# Altium project Switchberry.PrjPcb
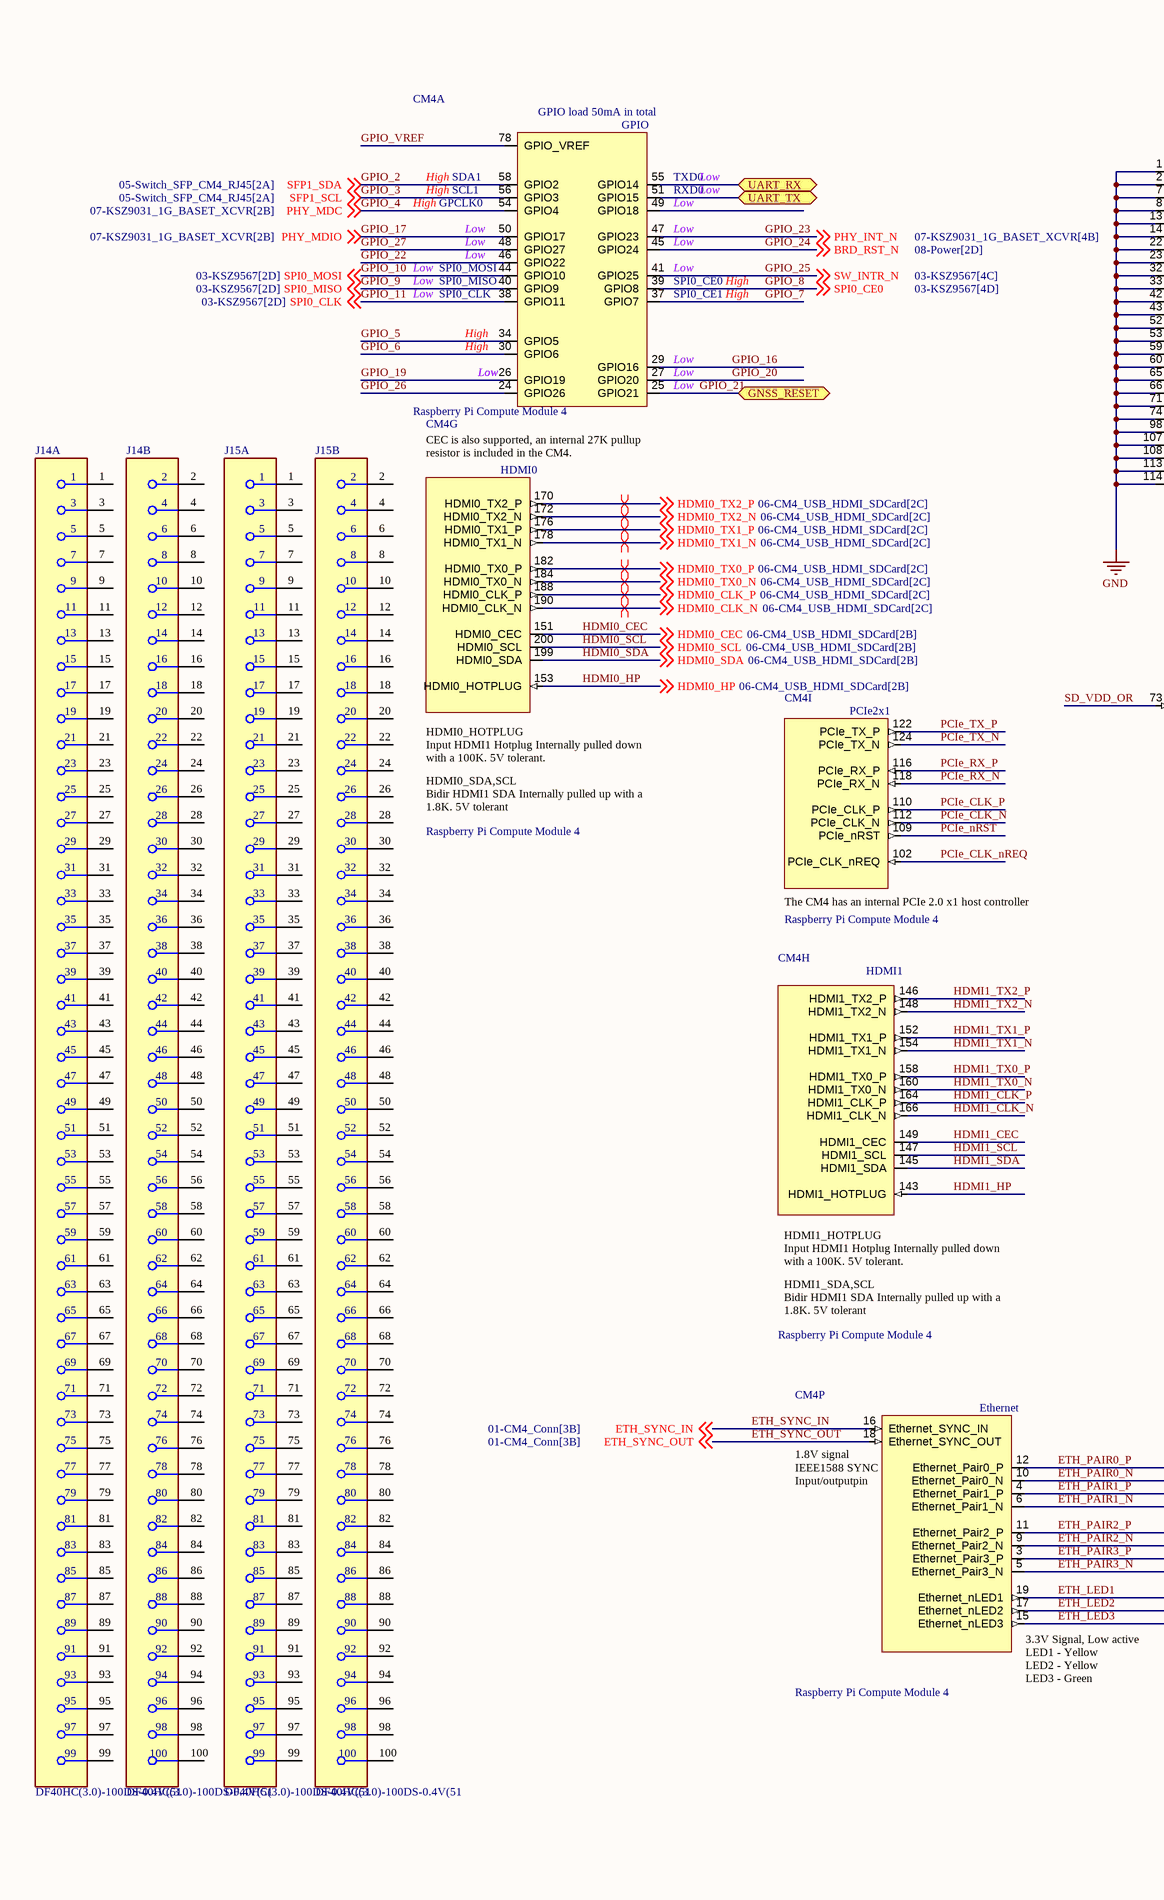
[diagram p0: 01-CM4_Conn.SchDoc, left]
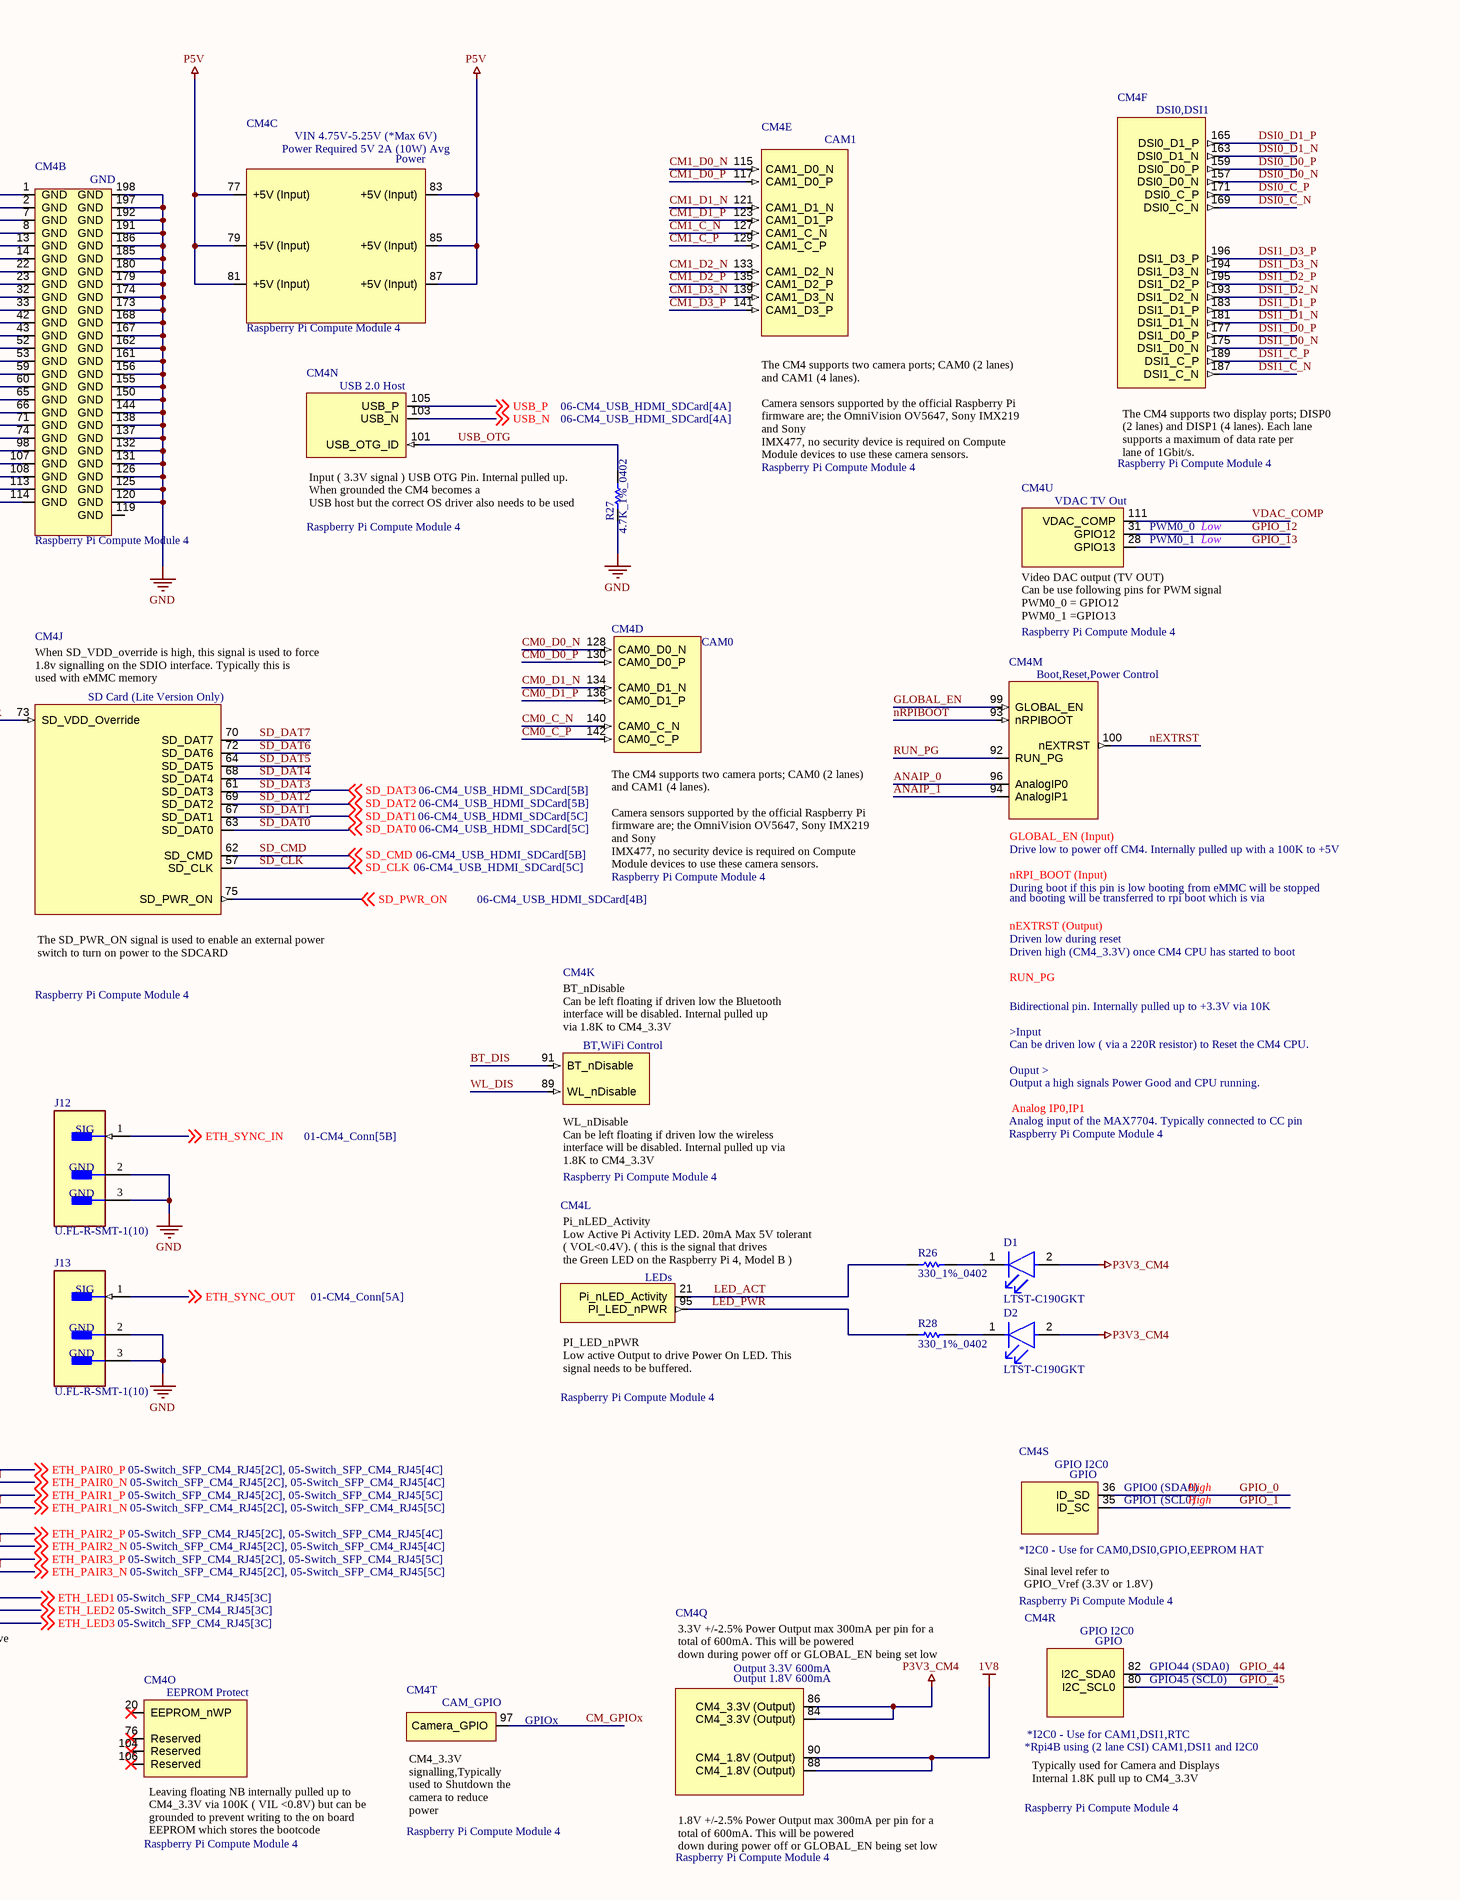
[diagram p1: 01-CM4_Conn.SchDoc, right]
3 sheets, 155 parts. Net scope: global (net labels, ports and power ports of the same name join across sheets).
Board file: Switchberry.PcbDoc
Sheets:
  01-CM4_Conn.SchDoc
  08-Power.SchDoc
  09-Switch_Power_Filters.SchDoc

## Sheet 01-CM4_Conn.SchDoc
size C; SheetNumber: 1; SheetTotal: 11

### Parts
CM4  Raspberry Pi Compute Module 4  [CM4-F40C-100DS-0.4v_1.5mm_0mm]  (parts A,B,C,D,E,F,G,H,I,J,K,L,M,N,O,P,Q,R,S,T,U of 21)  (no BOM)
D1  LTST-C190GKT  [FP-LTST-C190GKT-MFG]
D2  LTST-C190GKT  [FP-LTST-C190GKT-MFG]
J12  U.FL-R-SMT-1(10)  [FP-U_FL-R-SMT-1_10-MFG]
J13  U.FL-R-SMT-1(10)  [FP-U_FL-R-SMT-1_10-MFG]
J14  DF40HC(3.0)-100DS-0.4V(51  [FP-DF40HC_3_0_-100DS-0_4V-MFG]  (parts A,B of 2)
J15  DF40HC(3.0)-100DS-0.4V(51  [FP-DF40HC_3_0_-100DS-0_4V-MFG]  (parts A,B of 2)
R26  330_1%_0402  [RESC1005X40X25NL10T10]
R27  4.7K_1%_0402  [RESC1005X40X25NL10T10]
R28  330_1%_0402  [RESC1005X40X25NL10T10]

### Ports
GNSS_RESET (bidir), UART_RX (bidir), UART_TX (bidir)

### Nets
1V8: CM4.88(CM4_1.8V_(Output)) CM4.90(CM4_1.8V_(Output))
GND: CM4.1(GND) CM4.2(GND) CM4.7(GND) CM4.8(GND) CM4.13(GND) CM4.14(GND) CM4.22(GND) CM4.23(GND) CM4.32(GND) CM4.33(GND) CM4.42(GND) CM4.43(GND) CM4.52(GND) CM4.53(GND) CM4.59(GND) CM4.60(GND) CM4.65(GND) CM4.66(GND) CM4.71(GND) CM4.74(GND) CM4.98(GND) CM4.107(GND) CM4.108(GND) CM4.113(GND) CM4.114(GND) CM4.120(GND) CM4.125(GND) CM4.126(GND) CM4.131(GND) CM4.132(GND) CM4.137(GND) CM4.138(GND) CM4.144(GND) CM4.150(GND) CM4.155(GND) CM4.156(GND) CM4.161(GND) CM4.162(GND) CM4.167(GND) CM4.168(GND) CM4.173(GND) CM4.174(GND) CM4.179(GND) CM4.180(GND) CM4.185(GND) CM4.186(GND) CM4.191(GND) CM4.192(GND) CM4.197(GND) CM4.198(GND) J12.2(GND) J12.3(GND) J13.2(GND) J13.3(GND) R27.2
P3V3_CM4: CM4.84(CM4_3.3V_(Output)) CM4.86(CM4_3.3V_(Output)) D1.2(A) D2.2(A)
P5V: CM4.77(+5V_(Input)) CM4.79(+5V_(Input)) CM4.81(+5V_(Input)) CM4.83(+5V_(Input)) CM4.85(+5V_(Input)) CM4.87(+5V_(Input))
ANAIP_0: CM4.96(AnalogIP0)
ANAIP_1: CM4.94(AnalogIP1)
BT_DIS: CM4.91(BT_nDisable)
CM0_C_N: CM4.140(CAM0_C_N)
CM0_C_P: CM4.142(CAM0_C_P)
CM0_D0_N: CM4.128(CAM0_D0_N)
CM0_D0_P: CM4.130(CAM0_D0_P)
CM0_D1_N: CM4.134(CAM0_D1_N)
CM0_D1_P: CM4.136(CAM0_D1_P)
CM1_C_N: CM4.127(CAM1_C_N)
CM1_C_P: CM4.129(CAM1_C_P)
CM1_D0_N: CM4.115(CAM1_D0_N)
CM1_D0_P: CM4.117(CAM1_D0_P)
CM1_D1_N: CM4.121(CAM1_D1_N)
CM1_D1_P: CM4.123(CAM1_D1_P)
CM1_D2_N: CM4.133(CAM1_D2_N)
CM1_D2_P: CM4.135(CAM1_D2_P)
CM1_D3_N: CM4.139(CAM1_D3_N)
CM1_D3_P: CM4.141(CAM1_D3_P)
CM_GPIOx: CM4.97(Camera_GPIO)
DSI0_C_N: CM4.169(DSI0_C_N)
DSI0_C_P: CM4.171(DSI0_C_P)
DSI0_D0_N: CM4.157(DSI0_D0_N)
DSI0_D0_P: CM4.159(DSI0_D0_P)
DSI0_D1_N: CM4.163(DSI0_D1_N)
DSI0_D1_P: CM4.165(DSI0_D1_P)
DSI1_C_N: CM4.187(DSI1_C_N)
DSI1_C_P: CM4.189(DSI1_C_P)
DSI1_D0_N: CM4.175(DSI1_D0_N)
DSI1_D0_P: CM4.177(DSI1_D0_P)
DSI1_D1_N: CM4.181(DSI1_D1_N)
DSI1_D1_P: CM4.183(DSI1_D1_P)
DSI1_D2_N: CM4.193(DSI1_D2_N)
DSI1_D2_P: CM4.195(DSI1_D2_P)
DSI1_D3_N: CM4.194(DSI1_D3_N)
DSI1_D3_P: CM4.196(DSI1_D3_P)
ETH_LED1: CM4.19(Ethernet_nLED1) ; off-sheet ETH_LED1
ETH_LED2: CM4.17(Ethernet_nLED2) ; off-sheet ETH_LED2
ETH_LED3: CM4.15(Ethernet_nLED3) ; off-sheet ETH_LED3
ETH_PAIR0_N: CM4.10(Ethernet_Pair0_N) ; off-sheet ETH_PAIR0_N
ETH_PAIR0_P: CM4.12(Ethernet_Pair0_P) ; off-sheet ETH_PAIR0_P
ETH_PAIR1_N: CM4.6(Ethernet_Pair1_N) ; off-sheet ETH_PAIR1_N
ETH_PAIR1_P: CM4.4(Ethernet_Pair1_P) ; off-sheet ETH_PAIR1_P
ETH_PAIR2_N: CM4.9(Ethernet_Pair2_N) ; off-sheet ETH_PAIR2_N
ETH_PAIR2_P: CM4.11(Ethernet_Pair2_P) ; off-sheet ETH_PAIR2_P
ETH_PAIR3_N: CM4.5(Ethernet_Pair3_N) ; off-sheet ETH_PAIR3_N
ETH_PAIR3_P: CM4.3(Ethernet_Pair3_P) ; off-sheet ETH_PAIR3_P
ETH_SYNC_IN: CM4.16(Ethernet_SYNC_IN) J12.1(SIG) ; off-sheet ETH_SYNC_IN
ETH_SYNC_OUT: CM4.18(Ethernet_SYNC_OUT) J13.1(SIG) ; off-sheet ETH_SYNC_OUT
GLOBAL_EN: CM4.99(GLOBAL_EN)
GPIO_0: CM4.36(ID_SD)
GPIO_1: CM4.35(ID_SC)
GPIO_2: CM4.58(GPIO2) ; off-sheet SFP1_SDA  [also labelled SFP1_SDA]
GPIO_3: CM4.56(GPIO3) ; off-sheet SFP1_SCL  [also labelled SFP1_SCL]
GPIO_4: CM4.54(GPIO4) ; off-sheet PHY_MDC  [also labelled PHY_MDC]
GPIO_5: CM4.34(GPIO5)
GPIO_6: CM4.30(GPIO6)
GPIO_7: CM4.37(GPIO7)
GPIO_8: CM4.39(GPIO8) ; off-sheet SPI0_CE0  [also labelled SPI0_CE0]
GPIO_9: CM4.40(GPIO9) ; off-sheet SPI0_MISO  [also labelled SPI0_MISO]
GPIO_10: CM4.44(GPIO10) ; off-sheet SPI0_MOSI  [also labelled SPI0_MOSI]
GPIO_11: CM4.38(GPIO11) ; off-sheet SPI0_CLK  [also labelled SPI0_CLK]
GPIO_12: CM4.31(GPIO12)
GPIO_13: CM4.28(GPIO13)
GPIO_16: CM4.29(GPIO16)
GPIO_17: CM4.50(GPIO17) ; off-sheet PHY_MDIO  [also labelled PHY_MDIO]
GPIO_19: CM4.26(GPIO19)
GPIO_20: CM4.27(GPIO20)
GPIO_21: CM4.25(GPIO21) ; port GNSS_RESET
GPIO_22: CM4.46(GPIO22)
GPIO_23: CM4.47(GPIO23) ; off-sheet PHY_INT_N  [also labelled PHY_INT_N]
GPIO_24: CM4.45(GPIO24) ; off-sheet BRD_RST_N  [also labelled BRD_RST_N]
GPIO_25: CM4.41(GPIO25) ; off-sheet SW_INTR_N  [also labelled SW_INTR_N]
GPIO_26: CM4.24(GPIO26)
GPIO_27: CM4.48(GPIO27)
GPIO_44: CM4.82(I2C_SDA0)
GPIO_45: CM4.80(I2C_SCL0)
GPIO_VREF: CM4.78(GPIO_VREF)
HDMI0_CEC: CM4.151(HDMI0_CEC) ; off-sheet HDMI0_CEC
HDMI0_CLK_N: CM4.190(HDMI0_CLK_N) ; off-sheet HDMI0_CLK_N
HDMI0_CLK_P: CM4.188(HDMI0_CLK_P) ; off-sheet HDMI0_CLK_P
HDMI0_HP: CM4.153(HDMI0_HOTPLUG) ; off-sheet HDMI0_HP
HDMI0_SCL: CM4.200(HDMI0_SCL) ; off-sheet HDMI0_SCL
HDMI0_SDA: CM4.199(HDMI0_SDA) ; off-sheet HDMI0_SDA
HDMI0_TX0_N: CM4.184(HDMI0_TX0_N) ; off-sheet HDMI0_TX0_N
HDMI0_TX0_P: CM4.182(HDMI0_TX0_P) ; off-sheet HDMI0_TX0_P
HDMI0_TX1_N: CM4.178(HDMI0_TX1_N) ; off-sheet HDMI0_TX1_N
HDMI0_TX1_P: CM4.176(HDMI0_TX1_P) ; off-sheet HDMI0_TX1_P
HDMI0_TX2_N: CM4.172(HDMI0_TX2_N) ; off-sheet HDMI0_TX2_N
HDMI0_TX2_P: CM4.170(HDMI0_TX2_P) ; off-sheet HDMI0_TX2_P
HDMI1_CEC: CM4.149(HDMI1_CEC)
HDMI1_CLK_N: CM4.166(HDMI1_CLK_N)
HDMI1_CLK_P: CM4.164(HDMI1_CLK_P)
HDMI1_HP: CM4.143(HDMI1_HOTPLUG)
HDMI1_SCL: CM4.147(HDMI1_SCL)
HDMI1_SDA: CM4.145(HDMI1_SDA)
HDMI1_TX0_N: CM4.160(HDMI1_TX0_N)
HDMI1_TX0_P: CM4.158(HDMI1_TX0_P)
HDMI1_TX1_N: CM4.154(HDMI1_TX1_N)
HDMI1_TX1_P: CM4.152(HDMI1_TX1_P)
HDMI1_TX2_N: CM4.148(HDMI1_TX2_N)
HDMI1_TX2_P: CM4.146(HDMI1_TX2_P)
LED_ACT: CM4.21(Pi_nLED_Activity) R26.1
LED_PWR: CM4.95(PI_LED_nPWR) R28.1
nEXTRST: CM4.100(nEXTRST)
nRPIBOOT: CM4.93(nRPIBOOT)
PCIe_CLK_N: CM4.112(PCIe_CLK_N)
PCIe_CLK_nREQ: CM4.102(PCIe_CLK_nREQ)
PCIe_CLK_P: CM4.110(PCIe_CLK_P)
PCIe_nRST: CM4.109(PCIe_nRST)
PCIe_RX_N: CM4.118(PCIe_RX_N)
PCIe_RX_P: CM4.116(PCIe_RX_P)
PCIe_TX_N: CM4.124(PCIe_TX_N)
PCIe_TX_P: CM4.122(PCIe_TX_P)
RUN_PG: CM4.92(RUN_PG)
SD_CLK: CM4.57(SD_CLK) ; off-sheet SD_CLK
SD_CMD: CM4.62(SD_CMD) ; off-sheet SD_CMD
SD_DAT0: CM4.63(SD_DAT0) ; off-sheet SD_DAT0
SD_DAT1: CM4.67(SD_DAT1) ; off-sheet SD_DAT1
SD_DAT2: CM4.69(SD_DAT2) ; off-sheet SD_DAT2
SD_DAT3: CM4.61(SD_DAT3) ; off-sheet SD_DAT3
SD_DAT4: CM4.68(SD_DAT4)
SD_DAT5: CM4.64(SD_DAT5)
SD_DAT6: CM4.72(SD_DAT6)
SD_DAT7: CM4.70(SD_DAT7)
SD_PWR_ON: CM4.75(SD_PWR_ON) ; off-sheet SD_PWR_ON
SD_VDD_OR: CM4.73(SD_VDD_Override)
USB_N: CM4.103(USB_N) ; off-sheet USB_N
USB_OTG: CM4.101(USB_OTG_ID) R27.1
USB_P: CM4.105(USB_P) ; off-sheet USB_P
VDAC_COMP: CM4.111(VDAC_COMP)
WL_DIS: CM4.89(WL_nDisable)
NetCM4_51: CM4.51(GPIO15) ; port UART_TX
NetCM4_55: CM4.55(GPIO14) ; port UART_RX
NetD1_1: D1.1(C) R26.2
NetD2_1: D2.1(C) R28.2

Not connected (* = marked no-connect by the designer): CM4 20(EEPROM_nWP)* 49(GPIO18) 76(Reserved)* 104(Reserved)* 106(Reserved)* 119(GND); J14 1 2 3 4 5 6 7 8 9 10 11 12 13 14 15 16 17 18 19 20 21 22 23 24 25 26 27 28 29 30 31 32 33 34 35 36 37 38 39 40 41 42 43 44 45 46 47 48 49 50 51 52 53 54 55 56 57 58 59 60 61 62 63 64 65 66 67 68 69 70 71 72 73 74 75 76 77 78 79 80 81 82 83 84 85 86 87 88 89 90 91 92 93 94 95 96 97 98 99 100; J15 1 2 3 4 5 6 7 8 9 10 11 12 13 14 15 16 17 18 19 20 21 22 23 24 25 26 27 28 29 30 31 32 33 34 35 36 37 38 39 40 41 42 43 44 45 46 47 48 49 50 51 52 53 54 55 56 57 58 59 60 61 62 63 64 65 66 67 68 69 70 71 72 73 74 75 76 77 78 79 80 81 82 83 84 85 86 87 88 89 90 91 92 93 94 95 96 97 98 99 100

### Layout directives
differential pair: HDMI0_CLK_N, HDMI0_CLK_P, HDMI0_TX0_N, HDMI0_TX0_P, HDMI0_TX1_N, HDMI0_TX1_P, HDMI0_TX2_N, HDMI0_TX2_P

### Notes on the sheet
- DWG. NO.
- REV.
- SHT.
- REVISION
- DESCRIPTION
- DATE
- APPROVED
- THIS DOCUMENT AND THE DATA DISCLOSED HEREIN OR HEREWITH IS THE PROPERTY OF ALTIUM LIMITED AND MAY BE FREELY DISTRIBUTED IN WHOLE. NO RIGHTS ARE RESERVED OR EXPRESS OR IMPLIED WARANTEE GIVEN.
- ENG:
- DSN:
- APPROVALS
- PROJECT
- DOCUMENT REVISION:
- DESIGN ITEM:
- CHK:
- BOM:
- REFERENCE DOCUMENTS
- PROJECT REVISION:
- TITLE
- FAB DWG:
- PCB DWG:
- ASSY DWG:
- SCALE:
- SIZE
- C
- CAGE CODE
- FILE NAME
- DWG NO.
- SHEET
- OF
- REV
- (in symbol CM4, part A) GPIO load 50mA in total; GPIO; High; SDA1; TXD0; Low; SCL1; RXD0; GPCLK0; SPI0_MOSI; SPI0_MISO; SPI0_CE0; SPI0_CLK; SPI0_CE1; by Amornthep Phunsin
- (in symbol CM4, part C) VIN 4.75V-5.25V (*Max 6V); Power Required 5V 2A (10W) Avg; Power; by Amornthep Phunsin
- (in symbol CM4, part D) CAM0; The CM4 supports two camera ports; CAM0 (2 lanes) and CAM1 (4 lanes). / Camera sensors supported by the official Raspberry Pi firmware are; the OmniVision OV5647, Sony IMX219 and Sony / IMX477, no security device is required on Compute Module devices to use these camera sensors.
- (in symbol CM4, part E) CAM1; The CM4 supports two camera ports; CAM0 (2 lanes) and CAM1 (4 lanes). / Camera sensors supported by the official Raspberry Pi firmware are; the OmniVision OV5647, Sony IMX219 and Sony / IMX477, no security device is required on Compute Module devices to use these camera sensors.
- (in symbol CM4, part F) DSI0,DSI1; The CM4 supports two display ports; DISP0 (2 lanes) and DISP1 (4 lanes). Each lane supports a maximum of data rate per / lane of 1Gbit/s.
- (in symbol CM4, part G) HDMI0; CEC is also supported, an internal 27K pullup resistor is included in the CM4.; HDMI0_HOTPLUG / Input HDMI1 Hotplug Internally pulled down with a 100K. 5V tolerant.; HDMI0_SDA,SCL / Bidir HDMI1 SDA Internally pulled up with a 1.8K. 5V tolerant
- (in symbol CM4, part H) HDMI1; HDMI1_HOTPLUG / Input HDMI1 Hotplug Internally pulled down with a 100K. 5V tolerant.; HDMI1_SDA,SCL / Bidir HDMI1 SDA Internally pulled up with a 1.8K. 5V tolerant
- (in symbol CM4, part I) PCIe2x1; The CM4 has an internal PCIe 2.0 x1 host controller
- (in symbol CM4, part J) When SD_VDD_override is high, this signal is used to force 1.8v signalling on the SDIO interface. Typically this is / used with eMMC memory; SD Card (Lite Version Only); by Amornthep Phunsin; The SD_PWR_ON signal is used to enable an external power switch to turn on power to the SDCARD
- (in symbol CM4, part K) BT_nDisable / Can be left floating if driven low the Bluetooth interface will be disabled. Internal pulled up / via 1.8K to CM4_3.3V; BT,WiFi Control; WL_nDisable / Can be left floating if driven low the wireless interface will be disabled. Internal pulled up via / 1.8K to CM4_3.3V
- (in symbol CM4, part L) Pi_nLED_Activity / Low Active Pi Activity LED. 20mA Max 5V tolerant ( VOL<0.4V). ( this is the signal that drives / the Green LED on the Raspberry Pi 4, Model B ); LEDs; PI_LED_nPWR / Low active Output to drive Power On LED. This signal needs to be buffered.
- (in symbol CM4, part M) Boot,Reset,Power Control; GLOBAL_EN (Input); Drive low to power off CM4. Internally pulled up with a 100K to +5V; nRPI_BOOT (Input); During boot if this pin is low booting from eMMC will be stopped; and booting will be transferred to rpi boot which is via; nEXTRST (Output); Driven low during reset; Driven high (CM4_3.3V) once CM4 CPU has started to boot; Bidirectional pin. Internally pulled up to +3.3V via 10K / >Input / Can be driven low ( via a 220R resistor) to Reset the CM4 CPU. / Ouput > / Output a high signals Power Good and CPU running.; Analog IP0,IP1; Analog input of the MAX7704. Typically connected to CC pin
- (in symbol CM4, part N) USB 2.0 Host; Input ( 3.3V signal ) USB OTG Pin. Internal pulled up. When grounded the CM4 becomes a / USB host but the correct OS driver also needs to be used
- (in symbol CM4, part O) EEPROM Protect; Leaving floating NB internally pulled up to CM4_3.3V via 100K ( VIL <0.8V) but can be / grounded to prevent writing to the on board EEPROM which stores the bootcode
- (in symbol CM4, part P) Ethernet; 1.8V signal / IEEE1588 SYNC Input/outputpin; by Amornthep Phunsin; 3.3V Signal, Low active / LED1 - Yellow / LED2 - Yellow / LED3 - Green
- (in symbol CM4, part Q) 3.3V +/-2.5% Power Output max 300mA per pin for a total of 600mA. This will be powered / down during power off or GLOBAL_EN being set low; Output 3.3V 600mA; Output 1.8V 600mA; 1.8V +/-2.5% Power Output max 300mA per pin for a total of 600mA. This will be powered / down during power off or GLOBAL_EN being set low
- (in symbol CM4, part R) GPIO I2C0; GPIO; GPIO44 (SDA0); GPIO45 (SCL0); *I2C0 - Use for CAM1,DSI1,RTC; *Rpi4B using (2 lane CSI) CAM1,DSI1 and I2C0; Typically used for Camera and Displays Internal 1.8K pull up to CM4_3.3V
- (in symbol CM4, part S) GPIO I2C0; GPIO; GPIO0 (SDA0); High; GPIO1 (SCL0); *I2C0 - Use for CAM0,DSI0,GPIO,EEPROM HAT; Sinal level refer to  GPIO_Vref (3.3V or 1.8V)
- (in symbol CM4, part T) CAM_GPIO; GPIOx; CM4_3.3V signalling,Typically used to Shutdown the camera to reduce power
- (in symbol CM4, part U) VDAC TV Out; PWM0_0; Low; PWM0_1; Video DAC output (TV OUT) / Can be use following pins for PWM signal / PWM0_0 = GPIO12 / PWM0_1 =GPIO13

### Library data of the parts
CM4 = CM4: Raspberry Pi Compute Module 4 by Amornthep Phunsin
D1 D2 = CMP-22017-000005-2: LED GREEN CLEAR CHIP SMD; Dominant Wavelength: 569nm; Reverse Voltage: 5V; Lens Color: Colorless; Viewing Angle: 130°; Voltage: 2V; Forward Current: 30mA; Power Dissipation: 100mW; Luminous Intensity: 6mcd; Number of LEDs: 1; Forward Voltage: 2.1V; Wavelength: 565nm; Test Current: 10mA; Min Operating Temperature: -55°C; Lens Style: Clear; Mount: Surface Mount; Width: 0.8mm; Packaging: Tape and Reel; Lens Transparency: Clear; Case Code (Metric): 1608; Depth: 0.8mm; Case Code (Imperial): 0603; Case/Package: 0603; Number of Pins: 2; Max Operating Temperature: 85°C; Lead Free: Lead Free; Number of Elements: 1; Length: 1.6mm; Height: 0.8mm; Package Quantity: 1; Power Rating: 100mW; Radiation Hardening: No; Illumination Color: Green; Color: Green
J12 J13 = CMP-2000-05152-3: CONN U.FL RCPT STR 50 OHM SMD; Max Frequency: 6GHz; Connector Type: Coaxial; Body Plating: Silver; Body Material: Bronze; Impedance: 50R; Dielectric Material: Polymer; Insulation Resistance: 500MR; Gender: Male; Packaging: Cut Tape; Length: 3mm; Package Quantity: 2500; Termination: Solder; Lead Free: Lead Free; Series: U.FL; Min Operating Temperature: -40°C; Fastening Type: Snap; Contact Material: Brass; Orientation: Straight; Wire/Cable Type: Coaxial; Frequency: 6GHz; Contact Plating: Gold; Depth: 3.1mm; Weight: 0.001764oz; Max Operating Temperature: 90°C; Radiation Hardening: No; REACH SVHC: No SVHC; Mount: Surface Mount; Housing Color: Beige
J14 J15 = CMP-11605-000071-1: CONN RCPT 100POS SMD GOLD; Pitch: 0.016inch; Number of Positions: 100; Connector Type: Receptacle; Package Quantity: 3000; Contact Plating: Gold; Series: DF40; Mount: Surface Mount; Number of Rows: 2; Packaging: Tape and Reel
R26 R28 = CMP-2002-05853-1: Manufacturer: Panasonic; Part Number: ERA-2AED331X
R27 = CMP-2002-05217-1: Manufacturer: Bourns; Part Number: CR0402-FX-4701GLF

## Sheet 08-Power.SchDoc
size B; SheetNumber: 8; SheetTotal: 11
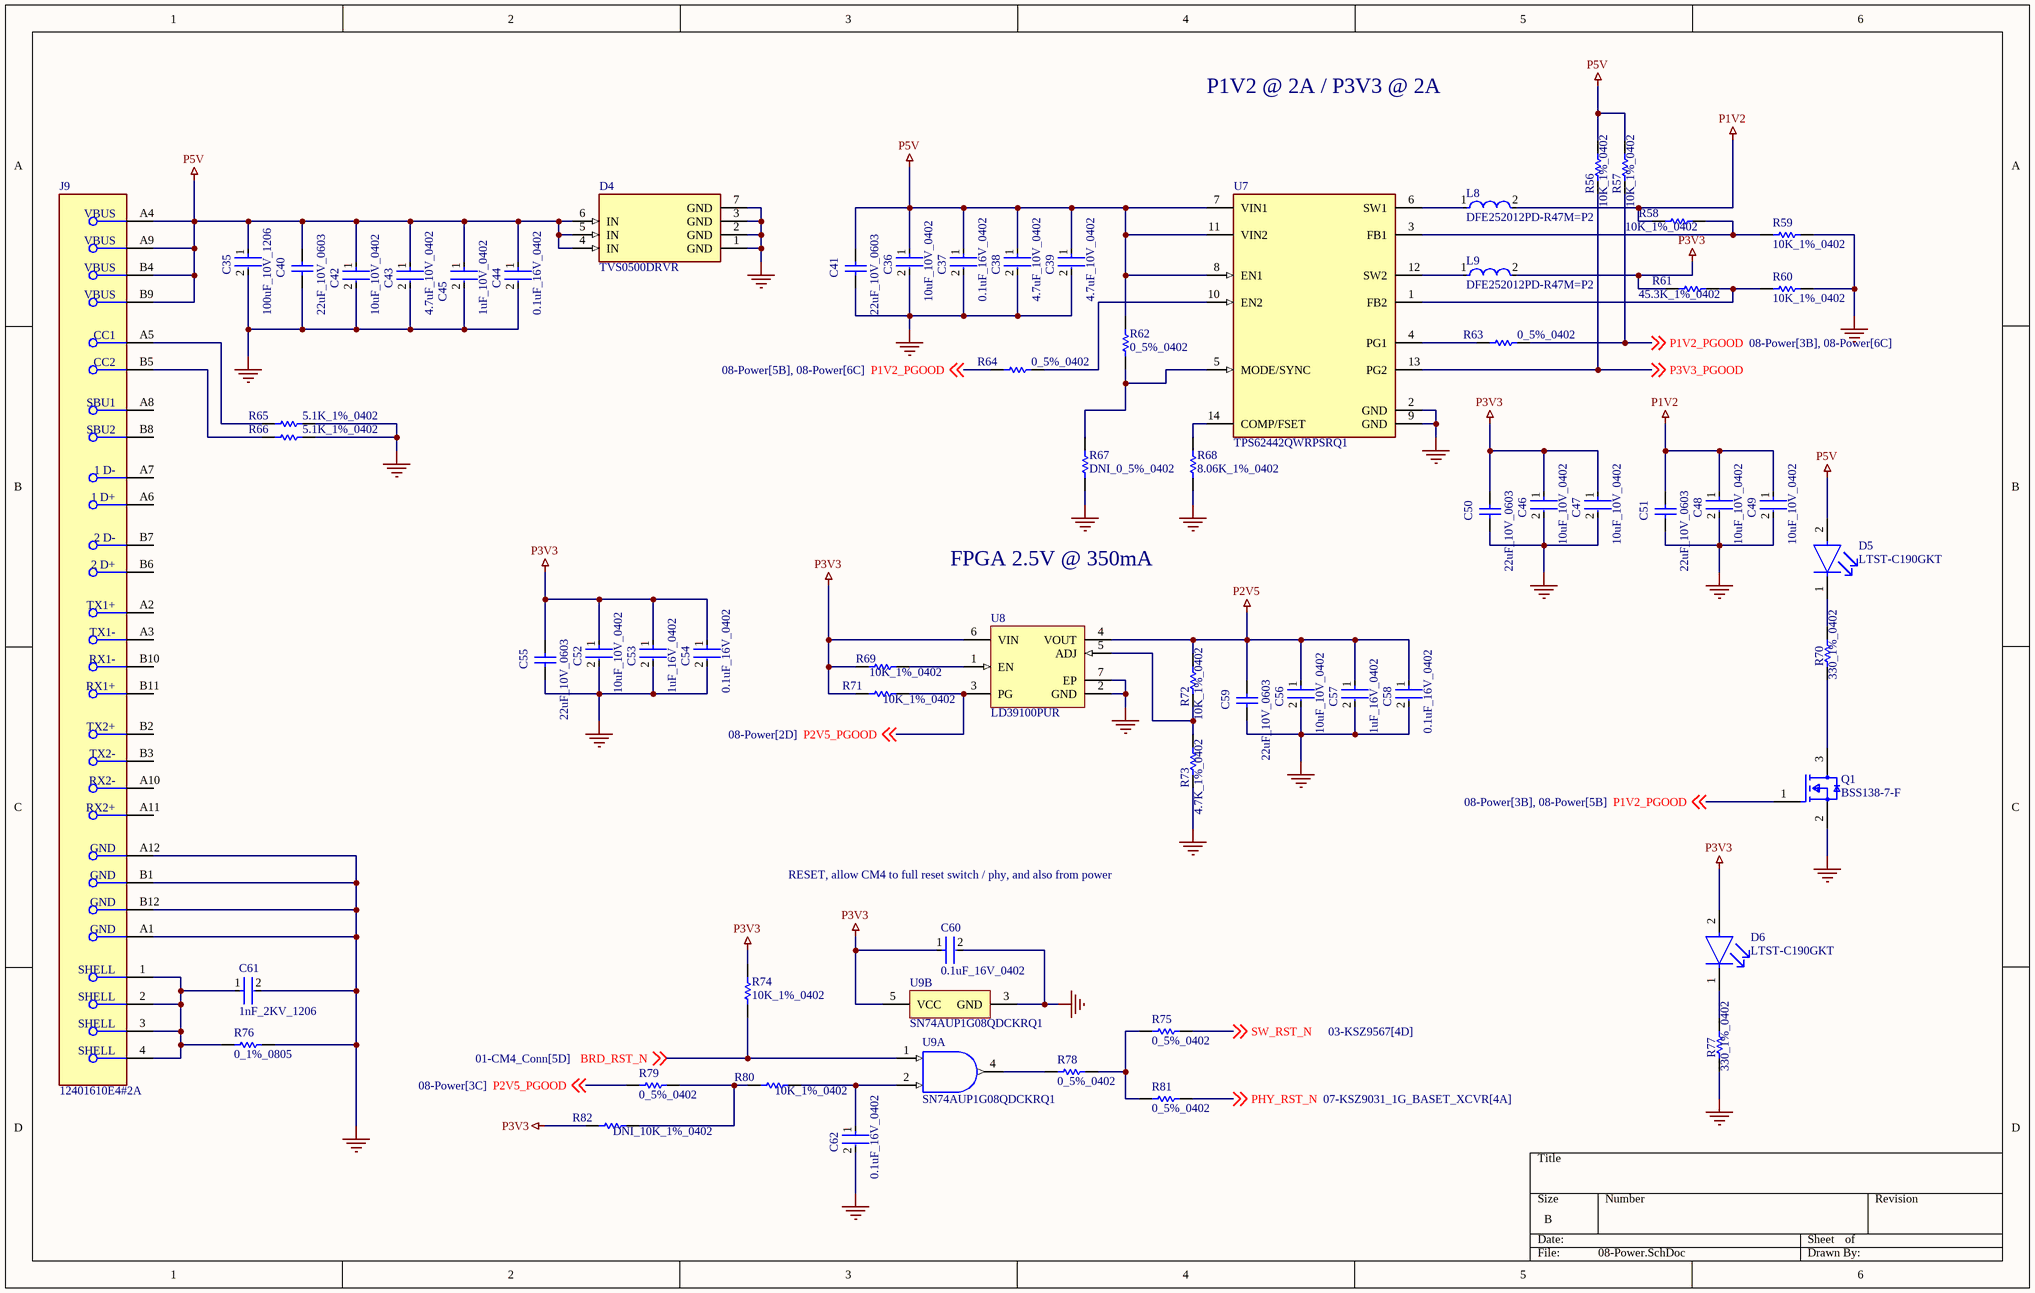
[diagram p2: 08-Power.SchDoc]

### Parts
C35  100uF_10V_1206  [FP-C3216-160-0_3-IPC_C]
C36  10uF_10V_0402  [FP-CL05A106MP5NUNC-MFG]
C37  0.1uF_16V_0402  [FP-C0402-BB-MFG]
C38  4.7uF_10V_0402  [FP-C1005-050-0_15-MFG]
C39  4.7uF_10V_0402  [FP-C1005-050-0_15-MFG]
C40  22uF_10V_0603  [CAPC1608X100X20ML10]
C41  22uF_10V_0603  [CAPC1608X100X20ML10]
C42  10uF_10V_0402  [FP-CL05A106MP5NUNC-MFG]
C43  4.7uF_10V_0402  [FP-C1005-050-0_15-MFG]
C44  0.1uF_16V_0402  [FP-C0402-BB-MFG]
C45  1uF_10V_0402  [FP-CL511-IPC_C]
C46  10uF_10V_0402  [FP-CL05A106MP5NUNC-MFG]
C47  10uF_10V_0402  [FP-CL05A106MP5NUNC-MFG]
C48  10uF_10V_0402  [FP-CL05A106MP5NUNC-MFG]
C49  10uF_10V_0402  [FP-CL05A106MP5NUNC-MFG]
C50  22uF_10V_0603  [CAPC1608X100X20ML10]
C51  22uF_10V_0603  [CAPC1608X100X20ML10]
C52  10uF_10V_0402  [FP-CL05A106MP5NUNC-MFG]
C53  1uF_16V_0402  [FP-0402-L_1_0_0_05-W_0_5-IPC_A]
C54  0.1uF_16V_0402  [FP-C0402-BB-MFG]
C55  22uF_10V_0603  [CAPC1608X100X20ML10]
C56  10uF_10V_0402  [FP-CL05A106MP5NUNC-MFG]
C57  1uF_16V_0402  [FP-0402-L_1_0_0_05-W_0_5-IPC_A]
C58  0.1uF_16V_0402  [FP-C0402-BB-MFG]
C59  22uF_10V_0603  [CAPC1608X100X20ML10]
C60  0.1uF_16V_0402  [FP-C0402-BB-MFG]
C61  1nF_2KV_1206  [FP-CC1206-0_3-1_45-IPC_C]
C62  0.1uF_16V_0402  [FP-C0402-BB-MFG]
D4  TVS0500DRVR  [FP-DRV0006A-MFG]
D5  LTST-C190GKT  [FP-LTST-C190GKT-MFG]
D6  LTST-C190GKT  [FP-LTST-C190GKT-MFG]
J9  12401610E4#2A  [FP-12401610E4#2A-MFG]
L8  DFE252012PD-R47M=P2  [FP-DFE252012C-IPC_A]
L9  DFE252012PD-R47M=P2  [FP-DFE252012C-IPC_A]
Q1  BSS138-7-F  [FP-SOT23_Standard-MFG]
R56  10K_1%_0402  [RESC1005X40X25NL10T10]
R57  10K_1%_0402  [RESC1005X40X25NL10T10]
R58  10K_1%_0402  [RESC1005X40X25NL10T10]
R59  10K_1%_0402  [RESC1005X40X25NL10T10]
R60  10K_1%_0402  [RESC1005X40X25NL10T10]
R61  45.3K_1%_0402  [RESC0402(1005)_L]
R62  0_5%_0402  [RESC1005X40X25NL05T10]
R63  0_5%_0402  [RESC1005X40X25NL05T10]
R64  0_5%_0402  [RESC1005X40X25NL05T10]
R65  5.1K_1%_0402  [RESC1005X40X25NL05T10]
R66  5.1K_1%_0402  [RESC1005X40X25NL05T10]
R67  DNI_0_5%_0402  [RESC1005X40X25NL05T10]  (no BOM)
R68  8.06K_1%_0402  [RESC1005X40X25ML05T05]
R69  10K_1%_0402  [RESC1005X40X25NL10T10]
R70  330_1%_0402  [RESC1005X40X25NL10T10]
R71  10K_1%_0402  [RESC1005X40X25NL10T10]
R72  10K_1%_0402  [RESC1005X40X25NL10T10]
R73  4.7K_1%_0402  [RESC1005X40X25NL10T10]
R74  10K_1%_0402  [RESC1005X40X25NL10T10]
R75  0_5%_0402  [RESC1005X40X25NL05T10]
R76  0_1%_0805  [RESC2013X60X35NL10T20]
R77  330_1%_0402  [RESC1005X40X25NL10T10]
R78  0_5%_0402  [RESC1005X40X25NL05T10]
R79  0_5%_0402  [RESC1005X40X25NL05T10]
R80  10K_1%_0402  [RESC1005X40X25NL10T10]
R81  0_5%_0402  [RESC1005X40X25NL05T10]
R82  DNI_10K_1%_0402  [RESC1005X40X25NL10T10]  (no BOM)
U7  TPS62442QWRPSRQ1  [FP-RQR0014A-MFG]
U8  LD39100PUR  [DFN6D_M]
U9  SN74AUP1G08QDCKRQ1  [DCK0005A_L]  (parts A,B of 2)

### Nets
GND: C35.2 C36.2 C37.2 C38.2 C39.2 C40.1 C41.1 C42.2 C43.2 C44.2 C45.2 C46.2 C47.2 C48.2 C49.2 C50.1 C51.1 C52.2 C53.2 C54.2 C55.1 C56.2 C57.2 C58.2 C59.1 C60.2 C61.2 C62.2 D4.1(GND) D4.2(GND) D4.3(GND) D4.7(GND) J9.A1(GND) J9.A12(GND) J9.B1(GND) J9.B12(GND) Q1.2(S) R59.1 R60.1 R65.2 R66.2 R67.1 R68.1 R73.1 R76.2 R77.1 U7.2(GND) U7.9(GND) U8.2(GND) U8.7(EP) U9.3(GND)
P1V2: C48.1 C49.1 C51.2 L8.2 R58.2
P2V5: C56.1 C57.1 C58.1 C59.2 R72.2 U8.4(VOUT)
P3V3: C46.1 C47.1 C50.2 C52.1 C53.1 C54.1 C55.2 C60.1 D6.2(A) L9.2 R61.1 R69.2 R71.2 R74.1 R82.2 U8.6(VIN) U9.5(VCC)
P5V: C35.1 C36.1 C37.1 C38.1 C39.1 C40.2 C41.2 C42.1 C43.1 C44.1 C45.1 D4.4(IN) D4.5(IN) D4.6(IN) D5.2(A) J9.A4(VBUS) J9.A9(VBUS) J9.B4(VBUS) J9.B9(VBUS) R56.2 R57.2 R62.2 U7.7(VIN1) U7.8(EN1) U7.11(VIN2)
BRD_RST_N: R74.2 U9.1(A) ; off-sheet BRD_RST_N  [project net GPIO_24]
P1V2_PGOOD: Q1.1(G) R57.1 R63.2 R64.1 ; off-sheet P1V2_PGOOD
P2V5_PGOOD: R71.1 R79.2 U8.3(PG) ; off-sheet P2V5_PGOOD
P3V3_PGOOD: R56.1 U7.13(PG2) ; off-sheet P3V3_PGOOD
PHY_RST_N: R81.1 ; off-sheet PHY_RST_N
SW_RST_N: R75.1 ; off-sheet SW_RST_N
NetC61_1: C61.1 J9.1(SHELL) J9.2(SHELL) J9.3(SHELL) J9.4(SHELL) R76.1
NetC62_1: C62.1 R80.1 U9.2(B)
NetD5_1: D5.1(C) R70.2
NetD6_1: D6.1(C) R77.2
NetJ9_A5: J9.A5(CC1) R65.1
NetJ9_B5: J9.B5(CC2) R66.1
NetL8_1: L8.1 U7.6(SW1)
NetL9_1: L9.1 U7.12(SW2)
NetQ1_3: Q1.3(D) R70.1
NetR58_1: R58.1 R59.2 U7.3(FB1)
NetR60_2: R60.2 R61.2 U7.1(FB2)
NetR62_1: R62.1 R67.2 U7.5(MODE/SYNC)
NetR63_1: R63.1 U7.4(PG1)
NetR64_2: R64.2 U7.10(EN2)
NetR68_2: R68.2 U7.14(COMP/FSET)
NetR69_1: R69.1 U8.1(EN)
NetR72_1: R72.1 R73.2 U8.5(ADJ)
NetR75_2: R75.2 R78.1 R81.2
NetR78_2: R78.2 U9.4(Y)
NetR79_1: R79.1 R80.2 R82.1

Not connected (* = marked no-connect by the designer): J9 A2(TX1+) A3(TX1-) A6(1_D+) A7(1_D-) A8(SBU1) A10(RX2-) A11(RX2+) B2(TX2+) B3(TX2-) B6(2_D+) B7(2_D-) B8(SBU2) B10(RX1-) B11(RX1+)

### Notes on the sheet
- P1V2 @ 2A / P3V3 @ 2A
- FPGA 2.5V @ 350mA
- RESET, allow CM4 to full reset switch / phy, and also from power

### Library data of the parts
C35 = CMP-2000-05396-3: Multilayer Ceramic Capacitors 100uF ±20% 10V X5R SMD 1206; Voltage Rating (DC): 10V; Length: 3.2mm; Mount: Surface Mount; Depth: 1.6mm; Width: 1.6mm; Package Quantity: 1; Min Operating Temperature: -55°C; Packaging: Tape and Reel; Max Operating Temperature: 85°C; Dielectric: X5R; Construction: Flat; Case Code (Imperial): 1206; Capacitance: 100uF; Thickness: 0.075inch; Radiation Hardening: No; RoHS Compliant: Yes; Series: C; Dielectric Material: Ceramic; Voltage: 10V; REACH SVHC: No SVHC; Case Code (Metric): 3216; Weight: 0.000571oz; Height: 1.6mm; Voltage Rating: 10V; Termination: SMD/SMT; Lead Free: Lead Free; Tolerance: 20%; Case/Package: 1206; Resistor Type: Ceramic
C36 C42 C46-C49 C52 C56 = CMP-13271-000002-1: CAP CER 10UF 10V X5R 0402; Manufacturer Part Number: CL05A106MP5NUNC; Manufacturer: Samsung; Temperature Coefficient: 15%; Tolerance: 20%; Material: Ceramic; Octopart: https://octopart.com/cl05a106mp5nunc-samsung-22457395; Voltage Rating: 10V; RoHS: TRUE; Value: 10uF; Height: 0.7mm; Digikey Description: CAP CER 10UF 10V X5R 0402; Automotive: No; Package: CL05A106MP5NUNC; Device Class L1: Passive Components; Capacitance: 10uF; Temperature Range High: +85°C; ComponentLink2Description: Datasheet; Device Class L2: Capacitors; Temperature Characteristic: X5R; Temperature: -55°C to +85°C; ComponentLink2URL: http://www.samsungsem.com/kr/support/product-search/mlcc/__icsFiles/afieldfile/2019/05/10/19-CL05A106MP5NUNC.pdf; Device Class L3: Ceramic Capacitors; Category: Cap; Temperature Range Low: -55°C; Ipc Land Pattern Name: CAPC10050X50; Lead Free: Yes
C37 C44 C54 C58 C60 C62 = CMP-1034-02068-3: CAP CER 0.1UF 16V 5% X7R 0402; Manufacturer: Kemet; Manufacturer Part Number: C0402C104J4RACTU; Value: 0.10 μF; Temperature Coefficient: 15%; Tolerance: 0.05; Material: Ceramic; ComponentLink2URL: https://content.kemet.com/datasheets/KEM_C1002_X7R_SMD.pdf; Automotive: No; Device Class L2: Capacitors; Temperature: -55°C to +125°C; RoHS: TRUE; Voltage Rating: 16 V; ComponentLink2Description: Datasheet; Device Class L3: Ceramic Capacitors; Temperature Range Low: -55°C; Ipc Land Pattern Name: CAPC10050X50; Device Class L1: Passive Components; Temperature Range High: +125°C; Package: C0402-BB; Capacitance: 0.10 μF; Category: Cap; Mouser Description: CAP CER 0.1UF 16V X7R 0402; Height: 0.55mm; Digikey Description: CAP CER 0.1UF 16V 5% X7R 0402; Octopart: https://octopart.com/c0402c104j4ractu-kemet-12573893; Temperature Characteristic: X7R; Lead Free: Yes
C38 C39 C43 = CMP-2000-05997-2: CAP CER 4.7UF 10V X5R 0402; Dielectric Material: Ceramic; Tolerance: 10%; Series: C; Package Quantity: 10000; Max Operating Temperature: 85°C; Case Code (Imperial): 0402; Lead Free: Lead Free; Voltage Rating (DC): 10V; Packaging: Cut Tape; Voltage Rating: 10V; Min Operating Temperature: -55°C; Dielectric: X5R; Thickness: 0.022inch; Width: 0.02inch; Case/Package: 0402; Case Code (Metric): 1005; Capacitance: 4.7uF; Length: 0.039inch; RoHS Compliant: Yes; REACH SVHC: No SVHC; Mount: Surface Mount
C40 C41 C50 C51 C55 C59 = CMP-2000-05441-1: Chip Capacitor, 22 uF, +/- 20%, 10 V, -55 to 85 degC, 0603 (1608 Metric), RoHS, Tape and Reel; Manufacturer: TDK; PCN Part Number: MLCCPartNumberChange30/Nov/2012; Voltage - Rated: 10V; Product Training Modules: CSeriesGeneralApplicationsSEAT,CCV,andTVCLDesignToolsGuidetoReplacinganElectrolyticCapacitorwithanMLCC; Other Names: 445-9077-1; Design Resources: 20WNon-IsolatedBuckLEDDriverUsingPLLNK460KG; Online Catalog: CSeries,GeneralPurpose; Capacitance: 22µF; Temperature Coefficient: X5R; Kits: 445-9014-KIT-ND-KITMLCC100PF-22UF060310-50V; Packaging: CutTape(CT); Standard Package: 1; Package / Case: 0603(1608Metric); Lead Style: -; Features: -; Ratings: -; Operating Temperature: -55degC~85degC; Applications: GeneralPurpose; Package Reference: 603; Datasheet URL: http://download.siliconexpert.com/pdfs/2015/4/21/15/54/45/779/tdk_/manual/37024850441143360mlcc_commercial_general_en.pdf; Datasheet Version: Mar-15; Mounting Type: SurfaceMount,MLCC; Lead Spacing: -; Size / Dimension: 0.063"Lx0.031"W(1.60mmx0.80mm); Height - Seated (Max): -; Package Description: 2-Pin Surface Mount Device, Body 1.6 x 0.8 mm; Manufacturer URL: http://www.tdk.com/; RoHS Information: RoHSCertificate-MLCC; Tolerance: ±20%; Series: C; Thickness (Max): 0.035"(0.90mm); Family: CeramicCapacitors; Category: Capacitors
C45 = CMP-13271-001936-1: Cap Ceramic 1uF 10V X5R ±10% SMD 0402 +85°C Paper T/R; Depth: 0.5mm; Case Code (Imperial): 0402; Material: Ceramic; Mount: Surface Mount; Thickness: 0.022inch; Dielectric: X5R; Capacitance: 1uF; Radiation Hardening: No; Case/Package: 0402; Length: 1mm; Tolerance: 10%; Max Operating Temperature: 85°C; Package Quantity: 1; Width: 0.02inch; Voltage Rating: 10V; Contact Plating: Tin; Height: 0.5mm; Min Operating Temperature: -55°C; Case Code (Metric): 1005; Packaging: Tape and Reel
C53 C57 = CMP-14477-000104-2: None; Tolerance: 10%; Voltage Rating: 16V; Dielectric: X5R; Capacitance: 1uF; Packaging: Tape and Reel; Depth: 0.5mm; Mount: Surface Mount; Thickness: 0.022inch; Package Quantity: 1; Min Operating Temperature: -55°C; Series: M; Voltage Rating (DC): 16V; Termination: SMD/SMT; Case/Package: 0402; Number of Pins: 2; Case Code (Imperial): 0402; Length: 1mm; Halogen Free: Halogen Free; Case Code (Metric): 1005; Width: 0.02inch; RoHS Compliant: Yes; Radiation Hardening: No; Max Operating Temperature: 85°C; Height: 0.5mm; Construction: Flat
C61 = CMP-2000-05436-2: CAP CER 1000PF 2KV X7R 1206; Capacitance: 1nF; Insulation Resistance: 10GR; Dissipation Factor: 2.5%; Tolerance: 10%; Termination: SMD/SMT; Voltage Rating (DC): 2kV; Case/Package: 1206; Length: 3.2mm; Depth: 1.6mm; Case Code (Imperial): 1206; Package Quantity: 1; Packaging: Tape and Reel; Dielectric: X7R; Mount: Surface Mount; Max Operating Temperature: 125°C; Lead Free: Lead Free; Number of Pins: 2; Thickness: 0.057inch; Width: 0.063inch; Resistor Type: Ceramic; Series: CC; RoHS Compliant: Yes; Voltage Rating: 2kV; Radiation Hardening: No; Construction: Flat; Height: 1.25mm; Min Operating Temperature: -55°C; Voltage: 2kV; Case Code (Metric): 3216
D4 = CMP-04989-000008-1: UNIDIR PRECISION SURGE DIODE; Peak Pulse Power: 400W; Power Line Protection: No; Reverse Standoff Voltage: 5V; Min Breakdown Voltage: 7.5V; Peak Pulse Current: 43A; Number of Unidirectional Channels: 1; Clamping Voltage: 9.5V; Packaging: Tape and Reel; Max Operating Temperature: 125°C; RoHS Compliant: Yes; Min Operating Temperature: -40°C; Mount: Surface Mount; Resistor Type: Zener; Number of Channels: 1
D5 D6 = CMP-22017-000005-2: as D1 on sheet 01-CM4_Conn; Min Operating Temperature: -55°C; Lens Style: Clear; Mount: Surface Mount; Width: 0.8mm; Packaging: Tape and Reel; Lens Transparency: Clear; Case Code (Metric): 1608; Depth: 0.8mm; Case Code (Imperial): 0603; Case/Package: 0603; Number of Pins: 2; Max Operating Temperature: 85°C; Lead Free: Lead Free; Number of Elements: 1; Length: 1.6mm; Height: 0.8mm; Package Quantity: 1; Power Rating: 100mW; Radiation Hardening: No; Illumination Color: Green; Color: Green
J9 = CMP-02355-000003-1: CONN RCP USB3.1 TYPEC 24P SMD RA; Connector Type: USB; Number of Contacts: 24; Gender: Receptacle; Packaging: Cut Tape; Mount: Surface Mount; Number of Pins: 24
L8 L9 = CMP-06042-015149-1: Shielded Wirewound Inductor 0.47uH 20% 4000mA 0.027Ω 1008 (2520)
Q1 = CMP-2000-04930-2: NexarPartId: 335900; Voltage: 50V; Fall Time: 25ns; Number of Elements: 1; Turn-On Delay Time: 20ns; Drain to Source Resistance: 1.4Ω; Element Configuration: Single; Max Power Dissipation: 300mW; Current Rating: 200mA; Max Junction Temperature (Tj): 150°C; Input Capacitance: 50pF; Threshold Voltage: 1.2V; Current: 2A; Rds On Max: 3.5Ω; Rise Time: 10ns; Gate to Source Voltage (Vgs): 20V; Number of Pins: 3; Width: 1.3mm; Case/Package: SOT-23; Lead Free: Lead Free; Height: 1.15mm; Packaging: Cut Tape; Length: 2.9mm; REACH SVHC: No SVHC; Weight: 7.994566mg; Voltage Rating (DC): 50V; Contact Plating: Tin; Power Dissipation: 300mW; Mount: Surface Mount; Min Operating Temperature: -55°C; RoHS: Compliant; Max Operating Temperature: 150°C; Schedule B: 8541210080, 8541210080; Drain to Source Breakdown Voltage: 50V; Continuous Drain Current (ID): 200mA; Resistance: 3.5Ω; Number of Channels: 1; Drain to Source Voltage (Vdss): 50V; Turn-Off Delay Time: 20ns; Nominal Vgs: 1.2V
R56-R60 R69 R71 R72 R74 R80 R82 = CMP-2002-04694-1: Manufacturer: Bourns; Part Number: CR0402-FX-1002GLF
R61 = CMP-1011-00697-1: 45K3 0.063W 1% 0402 (1005 Metric)  SMD; Case-EIA: 0402; Case-Metric: 1005; Value: 45300.00 Ohm; Technology: SMT; Tolerance: 1 %; Power: 0.063 W
R62-R64 R67 R75 R78 R79 R81 = CMP-2002-06457-1: Manufacturer: Panasonic; Part Number: ERJ-U020R00X
R65 R66 = CMP-2002-07753-1: Part Number: RC0402FR-075K1L; Manufacturer: Yageo / Phycomp
R68 = CMP-2002-00253-3: Chip Resistor, 8.06 KOhm, +/- 1%, 63 mW, -55 to 155 degC, 0402 (1005 Metric), RoHS, Tape and Reel; PartNumber: CRCW04028K06FKED; Manufacturer: Basic Passives; Case\/Package: 0402; Power Rating: 63 mW; Voltage Rating: 50 V; PackageReference: 0402; Radiation Hardening: No; Package Quantity: 10000; Height: 0.35 mm; Packaging: Tape and Reel; Mount: Surface Mount; Length: 1 mm; Weight: 2.3E-05oz; Case Code (Metric): 1005; DatasheetVersion: 06/2012; Pins: 2; Min Operating Temperature: -55 degC; Case Code (Imperial): 0402; REACH SVHC: Unknown; Tolerance: 1%; Mounting Technology: Surface Mount; ComponentLink1URL: http://www.vishay.com/; ComponentLink2URL: http://www.vishay.com/docs/20035/dcrcwe3.pdf; ComponentLink2Description: Datasheet; Resistance: 8.06 KOhm; Max Operating Temperature: 155 degC; ComponentLink1Description: Manufacturer URL; Width: 0.5 mm; RoHSCompliant: true; PackageDescription: 2-Pin Surface Mount Device, Body 1 x 0.5 mm
R70 R77 = CMP-2002-05853-1: as R26 on sheet 01-CM4_Conn
R73 = CMP-2002-05217-1: as R27 on sheet 01-CM4_Conn
R76 = CMP-2001-04478-1: Manufacturer: Yageo; Part Number: AC0805FR-070RL
U7 = CMP-04918-000654-1: Adjustable-Frequency Dual Step-Down Converter, 2.7-6V VIN, 0.6-5.5V 2A VOUT, VQFN-HR14
U8 = CMP-0244-00287-1: 1 A Low Quiescent Current Low Noise Voltage Regulator, Adjustable from 0.8V, 6-Pin VFDFPN, Tape and Reel; ComponentLink1URL: http://www.st.com; ComponentLink1Description: Manufacturer URL; ComponentLink2Description: Datasheet; DatasheetVersion: 1/10/2011; PackageDescription: 6-Pin Plastic, Dual LLP, 3 x 3 mm Body, 0.95 mm Pitch, Exposed Pad; PackageReference: DFN6D; ComponentLink2URL: http://www.st.com/internet/com/TECHNICAL_RESOURCES/TECHNICAL_LITERATURE/DATASHEET/CD00233788.pdf; PackageVersion: 2008
U9 = CMP-0859-00286-3: Automotive Catalog Low-Power Single 2-Input Positive-AND Gate, DCK0005A, LARGE T&R; Manufacturer: Texas Instruments; Generic Part Number: SN74AUP1G08-Q1; VCC(Min)(V): 0.8; Voltage(Nom)(V): 0.8,1.2,1.5,1.8,2.5,3.3; Input Type: CMOS; F @ Nom Voltage(Max)(Mhz): 100; tpd @ Nom Voltage(Max)(ns): 32.8,20.9,14.2,11,7.6,6.2; Gate Type: AND; Technology Family: AUP; VCC(Max)(V): 3.6; ICC @ Nom Voltage(Max)(mA): 0.0009; Output Drive (IOL/IOH)(Max)(mA): 20/-20; Schmitt Trigger: No; Bits(#): 1; Logic: True; Sub-Family: AND Gate; DatasheetVersion: SCES847; Rating: Automotive; Output Type: CMOS; Operating Temperature Range(C): -40 to 125; PackageReference: DCK0005A; 3-State Output: No

## Sheet 09-Switch_Power_Filters.SchDoc
size B; SheetNumber: 9; SheetTotal: 11
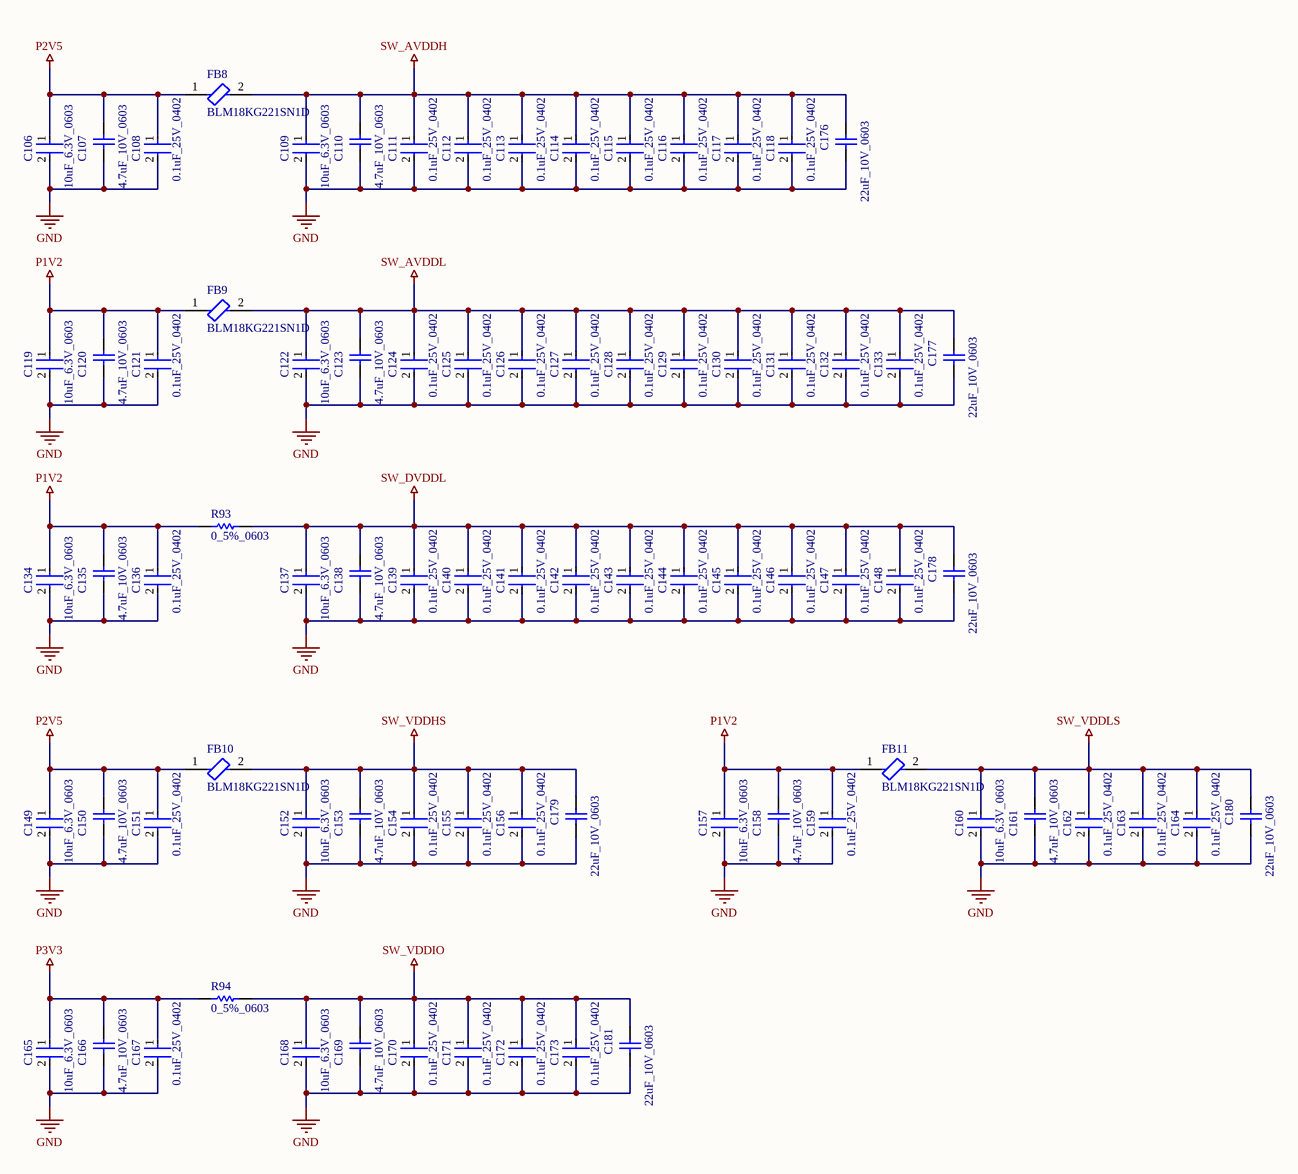
[diagram p3: 09-Switch_Power_Filters.SchDoc]

### Parts
C106  10uF_6.3V_0603  [FP-C0603C106M9PACTU-MFG]
C107  4.7uF_10V_0603  [CAPC1608X87X35NL15T15]
C108  0.1uF_25V_0402  [FP-0402-L_1_0_1-W_0_5_0_1-IPC_C]
C109  10uF_6.3V_0603  [FP-C0603C106M9PACTU-MFG]
C110  4.7uF_10V_0603  [CAPC1608X87X35NL15T15]
C111  0.1uF_25V_0402  [FP-0402-L_1_0_1-W_0_5_0_1-IPC_C]
C112  0.1uF_25V_0402  [FP-0402-L_1_0_1-W_0_5_0_1-IPC_C]
C113  0.1uF_25V_0402  [FP-0402-L_1_0_1-W_0_5_0_1-IPC_C]
C114  0.1uF_25V_0402  [FP-0402-L_1_0_1-W_0_5_0_1-IPC_C]
C115  0.1uF_25V_0402  [FP-0402-L_1_0_1-W_0_5_0_1-IPC_C]
C116  0.1uF_25V_0402  [FP-0402-L_1_0_1-W_0_5_0_1-IPC_C]
C117  0.1uF_25V_0402  [FP-0402-L_1_0_1-W_0_5_0_1-IPC_C]
C118  0.1uF_25V_0402  [FP-0402-L_1_0_1-W_0_5_0_1-IPC_C]
C119  10uF_6.3V_0603  [FP-C0603C106M9PACTU-MFG]
C120  4.7uF_10V_0603  [CAPC1608X87X35NL15T15]
C121  0.1uF_25V_0402  [FP-0402-L_1_0_1-W_0_5_0_1-IPC_C]
C122  10uF_6.3V_0603  [FP-C0603C106M9PACTU-MFG]
C123  4.7uF_10V_0603  [CAPC1608X87X35NL15T15]
C124  0.1uF_25V_0402  [FP-0402-L_1_0_1-W_0_5_0_1-IPC_C]
C125  0.1uF_25V_0402  [FP-0402-L_1_0_1-W_0_5_0_1-IPC_C]
C126  0.1uF_25V_0402  [FP-0402-L_1_0_1-W_0_5_0_1-IPC_C]
C127  0.1uF_25V_0402  [FP-0402-L_1_0_1-W_0_5_0_1-IPC_C]
C128  0.1uF_25V_0402  [FP-0402-L_1_0_1-W_0_5_0_1-IPC_C]
C129  0.1uF_25V_0402  [FP-0402-L_1_0_1-W_0_5_0_1-IPC_C]
C130  0.1uF_25V_0402  [FP-0402-L_1_0_1-W_0_5_0_1-IPC_C]
C131  0.1uF_25V_0402  [FP-0402-L_1_0_1-W_0_5_0_1-IPC_C]
C132  0.1uF_25V_0402  [FP-0402-L_1_0_1-W_0_5_0_1-IPC_C]
C133  0.1uF_25V_0402  [FP-0402-L_1_0_1-W_0_5_0_1-IPC_C]
C134  10uF_6.3V_0603  [FP-C0603C106M9PACTU-MFG]
C135  4.7uF_10V_0603  [CAPC1608X87X35NL15T15]
C136  0.1uF_25V_0402  [FP-0402-L_1_0_1-W_0_5_0_1-IPC_C]
C137  10uF_6.3V_0603  [FP-C0603C106M9PACTU-MFG]
C138  4.7uF_10V_0603  [CAPC1608X87X35NL15T15]
C139  0.1uF_25V_0402  [FP-0402-L_1_0_1-W_0_5_0_1-IPC_C]
C140  0.1uF_25V_0402  [FP-0402-L_1_0_1-W_0_5_0_1-IPC_C]
C141  0.1uF_25V_0402  [FP-0402-L_1_0_1-W_0_5_0_1-IPC_C]
C142  0.1uF_25V_0402  [FP-0402-L_1_0_1-W_0_5_0_1-IPC_C]
C143  0.1uF_25V_0402  [FP-0402-L_1_0_1-W_0_5_0_1-IPC_C]
C144  0.1uF_25V_0402  [FP-0402-L_1_0_1-W_0_5_0_1-IPC_C]
C145  0.1uF_25V_0402  [FP-0402-L_1_0_1-W_0_5_0_1-IPC_C]
C146  0.1uF_25V_0402  [FP-0402-L_1_0_1-W_0_5_0_1-IPC_C]
C147  0.1uF_25V_0402  [FP-0402-L_1_0_1-W_0_5_0_1-IPC_C]
C148  0.1uF_25V_0402  [FP-0402-L_1_0_1-W_0_5_0_1-IPC_C]
C149  10uF_6.3V_0603  [FP-C0603C106M9PACTU-MFG]
C150  4.7uF_10V_0603  [CAPC1608X87X35NL15T15]
C151  0.1uF_25V_0402  [FP-0402-L_1_0_1-W_0_5_0_1-IPC_C]
C152  10uF_6.3V_0603  [FP-C0603C106M9PACTU-MFG]
C153  4.7uF_10V_0603  [CAPC1608X87X35NL15T15]
C154  0.1uF_25V_0402  [FP-0402-L_1_0_1-W_0_5_0_1-IPC_C]
C155  0.1uF_25V_0402  [FP-0402-L_1_0_1-W_0_5_0_1-IPC_C]
C156  0.1uF_25V_0402  [FP-0402-L_1_0_1-W_0_5_0_1-IPC_C]
C157  10uF_6.3V_0603  [FP-C0603C106M9PACTU-MFG]
C158  4.7uF_10V_0603  [CAPC1608X87X35NL15T15]
C159  0.1uF_25V_0402  [FP-0402-L_1_0_1-W_0_5_0_1-IPC_C]
C160  10uF_6.3V_0603  [FP-C0603C106M9PACTU-MFG]
C161  4.7uF_10V_0603  [CAPC1608X87X35NL15T15]
C162  0.1uF_25V_0402  [FP-0402-L_1_0_1-W_0_5_0_1-IPC_C]
C163  0.1uF_25V_0402  [FP-0402-L_1_0_1-W_0_5_0_1-IPC_C]
C164  0.1uF_25V_0402  [FP-0402-L_1_0_1-W_0_5_0_1-IPC_C]
C165  10uF_6.3V_0603  [FP-C0603C106M9PACTU-MFG]
C166  4.7uF_10V_0603  [CAPC1608X87X35NL15T15]
C167  0.1uF_25V_0402  [FP-0402-L_1_0_1-W_0_5_0_1-IPC_C]
C168  10uF_6.3V_0603  [FP-C0603C106M9PACTU-MFG]
C169  4.7uF_10V_0603  [CAPC1608X87X35NL15T15]
C170  0.1uF_25V_0402  [FP-0402-L_1_0_1-W_0_5_0_1-IPC_C]
C171  0.1uF_25V_0402  [FP-0402-L_1_0_1-W_0_5_0_1-IPC_C]
C172  0.1uF_25V_0402  [FP-0402-L_1_0_1-W_0_5_0_1-IPC_C]
C173  0.1uF_25V_0402  [FP-0402-L_1_0_1-W_0_5_0_1-IPC_C]
C176  22uF_10V_0603  [CAPC1608X100X20ML10]
C177  22uF_10V_0603  [CAPC1608X100X20ML10]
C178  22uF_10V_0603  [CAPC1608X100X20ML10]
C179  22uF_10V_0603  [CAPC1608X100X20ML10]
C180  22uF_10V_0603  [CAPC1608X100X20ML10]
C181  22uF_10V_0603  [CAPC1608X100X20ML10]
FB8  BLM18KG221SN1D  [FP-BLM18-0_15-t0_8-IPC_B]
FB9  BLM18KG221SN1D  [FP-BLM18-0_15-t0_8-IPC_B]
FB10  BLM18KG221SN1D  [FP-BLM18-0_15-t0_8-IPC_B]
FB11  BLM18KG221SN1D  [FP-BLM18-0_15-t0_8-IPC_B]
R93  0_5%_0603  [RESC1608X55X25ML10T15]
R94  0_5%_0603  [RESC1608X55X25ML10T15]

### Nets
GND: C106.2 C107.1 C108.2 C109.2 C110.1 C111.2 C112.2 C113.2 C114.2 C115.2 C116.2 C117.2 C118.2 C119.2 C120.1 C121.2 C122.2 C123.1 C124.2 C125.2 C126.2 C127.2 C128.2 C129.2 C130.2 C131.2 C132.2 C133.2 C134.2 C135.1 C136.2 C137.2 C138.1 C139.2 C140.2 C141.2 C142.2 C143.2 C144.2 C145.2 C146.2 C147.2 C148.2 C149.2 C150.1 C151.2 C152.2 C153.1 C154.2 C155.2 C156.2 C157.2 C158.1 C159.2 C160.2 C161.1 C162.2 C163.2 C164.2 C165.2 C166.1 C167.2 C168.2 C169.1 C170.2 C171.2 C172.2 C173.2 C176.1 C177.1 C178.1 C179.1 C180.1 C181.1
P1V2: C119.1 C120.2 C121.1 C134.1 C135.2 C136.1 C157.1 C158.2 C159.1 FB9.1 FB11.1 R93.1
P2V5: C106.1 C107.2 C108.1 C149.1 C150.2 C151.1 FB8.1 FB10.1
P3V3: C165.1 C166.2 C167.1 R94.1
SW_AVDDH: C109.1 C110.2 C111.1 C112.1 C113.1 C114.1 C115.1 C116.1 C117.1 C118.1 C176.2 FB8.2
SW_AVDDL: C122.1 C123.2 C124.1 C125.1 C126.1 C127.1 C128.1 C129.1 C130.1 C131.1 C132.1 C133.1 C177.2 FB9.2
SW_DVDDL: C137.1 C138.2 C139.1 C140.1 C141.1 C142.1 C143.1 C144.1 C145.1 C146.1 C147.1 C148.1 C178.2 R93.2
SW_VDDHS: C152.1 C153.2 C154.1 C155.1 C156.1 C179.2 FB10.2
SW_VDDIO: C168.1 C169.2 C170.1 C171.1 C172.1 C173.1 C181.2 R94.2
SW_VDDLS: C160.1 C161.2 C162.1 C163.1 C164.1 C180.2 FB11.2

### Library data of the parts
C106 C109 C119 C122 C134 C137 C149 C152 C157 C160 C165 C168 = CMP-2006-02285-3: CAP CER 10UF 6.3V X5R 0603; Manufacturer Part Number: C0603C106M9PACTU; Manufacturer: Kemet; Material: Ceramic; Temperature Coefficient: 15%; Tolerance: 20%; Category: Cap; Height: 0.9mm; Digikey Description: CAP CER 10UF 6.3V X5R 0603; Mouser Description: In a Pack of 10, KEMET 0603 (1608M) 10µF MLCC 6.3V dc ±20% SMD C0603C106M9PACTU; Voltage Rating: 6.3V; Device Class L2: Capacitors; Temperature Range Low: -55°C; Temperature Characteristic: X5R; ComponentLink2Description: Datasheet; Ipc Land Pattern Name: CAPC16080X80; ComponentLink2URL: http://www.kemet.com/Lists/ProductCatalog/Attachments/19/KEM_C1006_X5R_SMD.pdf; Capacitance: 10uF; Temperature Range High: +85°C; Device Class L3: Ceramic Capacitors; RoHS: TRUE; Automotive: No; Value: 10uF; Temperature: -55°C to +85°C; Device Class L1: Passive Components; Package: C0603C106M9PACTU; Lead Free: Yes; Octopart: https://octopart.com/c0603c106m9pactu-kemet-8375727
C107 C110 C120 C123 C135 C138 C150 C153 C158 C161 C166 C169 = CMP-2006-03238-1: Part Number: C0603C475K8PACTU; Manufacturer: Kemet
C108 C111-C118 C121 C124-C133 C136 C139-C148 C151 C154-C156 C159 C162-C164 C167 C170-C173 = CMP-2008-02519-2: General Purpose Ceramic Capacitor, 0402, 100nF, 10%, X7R, 15%, 25V; Package Quantity: 1; Capacitance: 100nF; Min Operating Temperature: -55°C; Voltage: 25V; Voltage Rating: 25V; Construction: Flat; Max Operating Temperature: 125°C; Radiation Hardening: No; Depth: 0.5mm; Thickness: 0.022inch; Voltage Rating (DC): 25V; Number of Pins: 2; Lead Free: Lead Free; Series: -; REACH SVHC: No SVHC; Length: 1mm; Dielectric: X7R; RoHS Compliant: Yes; Mount: Surface Mount; Packaging: Tape and Reel; Case/Package: 0402; Case Code (Imperial): 0402; Termination: SMD/SMT; Width: 0.02inch; Case Code (Metric): 1005; Tolerance: 10%
C176-C181 = CMP-2000-05441-1: as C40 on sheet 08-Power; Packaging: CutTape(CT); Standard Package: 1; Package / Case: 0603(1608Metric); Lead Style: -; Features: -; Ratings: -; Operating Temperature: -55degC~85degC; Applications: GeneralPurpose; Package Reference: 603; Datasheet URL: http://download.siliconexpert.com/pdfs/2015/4/21/15/54/45/779/tdk_/manual/37024850441143360mlcc_commercial_general_en.pdf; Datasheet Version: Mar-15; Mounting Type: SurfaceMount,MLCC; Lead Spacing: -; Size / Dimension: 0.063"Lx0.031"W(1.60mmx0.80mm); Height - Seated (Max): -; Package Description: 2-Pin Surface Mount Device, Body 1.6 x 0.8 mm; Manufacturer URL: http://www.tdk.com/; RoHS Information: RoHSCertificate-MLCC; Tolerance: ±20%; Series: C; Thickness (Max): 0.035"(0.90mm); Family: CeramicCapacitors; Category: Capacitors
FB8-FB11 = CMP-0686-00556-7: Chip Ferrite Bead, 0603, 220Ω @ 100MHz, 0.05Ω, 25%, 2.2A; DC Resistance (DCR): 50mR; Number of Circuits: 1; Impedance: 220R; Current Rating: 2.2A; Material: Ferrite; Test Frequency: 100MHz; Depth: 0.8mm; Series: BLM18K; RoHS Compliant: Yes; Termination: SMD/SMT; Max Current Rating: 2.2A; Case Code (Metric): 1608; Radiation Hardening: No; Number of Pins: 2; Length: 1.6mm; Lead Free: Lead Free; Package Quantity: 1; Height: 0.8mm; Core Material: Ferrite; Inductor Type: FERRITE BEAD; Min Operating Temperature: -55°C; Case/Package: 0603; Case Code (Imperial): 0603; Number of Lines: 1; Packaging: Tape and Reel; REACH SVHC: No SVHC; Max Operating Temperature: 125°C; Military Standard: Not; DC Resistance-Max: 50mR; Width: 0.8mm; DC Current: 2.2A; Max DC Current: 2.2A; Tolerance: 25%; Weight: 7.1E-05oz
R93 R94 = CMP-2100-03667-1: Chip Resistor, 0 Ohm, +/- 5%, 0.1 W, -55 to 155 degC, 0603 (1608 Metric), RoHS, Tape and Reel; Manufacturer: Yageo; Temperature Coefficient: 200ppm/degreesC; Voltage Rating: 50V; Power Rating: 100mW; Resistance: 0mOhm; Width: 0.8mm; Max Operating Temperature: 155degC; Tolerance: 5%; Package Reference: 0603; Height: 0.45mm; Depth: 0.8mm; Package Description: 2-Pin Surface Mount Device, Body 1.6 x 0.8 mm; Termination: SMD/SMT; Package Quantity: 5000; Case/Package: 0603; Case Code (Imperial): 0603; Radiation Hardening: No; Number of Pins: 2; Length: 1.6mm; Lead Free: LeadFree; Voltage Rating (DC): 50V; Military Standard: Not; Datasheet URL: http://www.yageo.com/NewPortal/yageodocoutput?fileName=/pdf/R-Chip/PYu-RC_Group_51_RoHS_L_5.pdf; Manufacturer URL: http://www.yageo.com/; Packaging: TapeandReel; Case Code (Metric): 1608; Min Operating Temperature: -55degC; Composition: ThickFilm; RoHSCompliant: true; Contact Plating: Tin; Datasheet Version: Rev. 5, 10/2016; REACH SVHC: NoSVHC

## Nets that join several sheets
GND: 01-CM4_Conn (55 pins), 08-Power (51 pins), 09-Switch_Power_Filters (74 pins)
P1V2: 08-Power (5 pins), 09-Switch_Power_Filters (12 pins)
P2V5: 08-Power (6 pins), 09-Switch_Power_Filters (8 pins)
P3V3: 08-Power (17 pins), 09-Switch_Power_Filters (C165.1 C166.2 C167.1 R94.1)
P5V: 01-CM4_Conn (6 pins), 08-Power (25 pins)
GPIO_24: 01-CM4_Conn (CM4.45), 08-Power (R74.2 U9.1)